# Altium schematic sheet Sheet1.SchDoc
size A
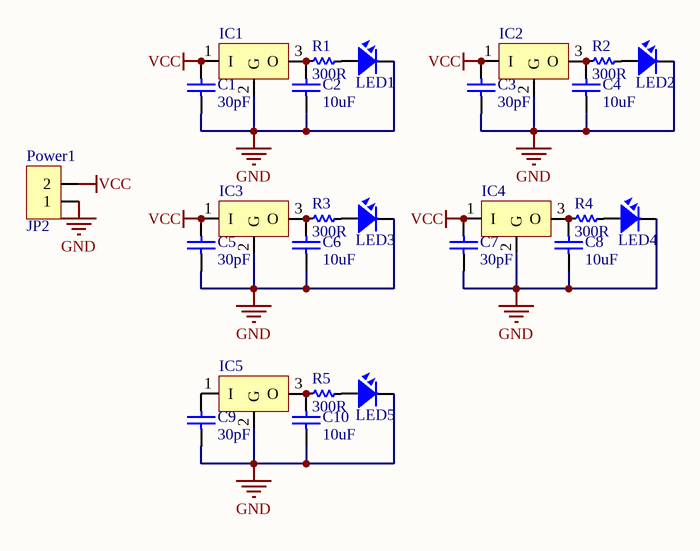
[diagram p0: Sheet1.SchDoc]

## Parts
C1  value 30pF  [C-NP-0805]  (hidden comment: Cap Non-pol)
C2  value 10uF  [C-NP-0805]  (hidden comment: Cap Non-pol)
C3  value 30pF  [C-NP-0805]  (hidden comment: Cap Non-pol)
C4  value 10uF  [C-NP-0805]  (hidden comment: Cap Non-pol)
C5  value 30pF  [C-NP-0805]  (hidden comment: Cap Non-pol)
C6  value 10uF  [C-NP-0805]  (hidden comment: Cap Non-pol)
C7  value 30pF  [C-NP-0805]  (hidden comment: Cap Non-pol)
C8  value 10uF  [C-NP-0805]  (hidden comment: Cap Non-pol)
C9  value 30pF  [C-NP-0805]  (hidden comment: Cap Non-pol)
C10  value 10uF  [C-NP-0805]  (hidden comment: Cap Non-pol)
IC1  LM78xx  [TO252-123]  (value not drawn)
IC2  LM78xx  [TO252-123]  (value not drawn)
IC3  LM78xx  [TO252-123]  (value not drawn)
IC4  LM78xx  [TO252-123]  (value not drawn)
IC5  LM78xx  [TO252-123]  (value not drawn)
LED1  LED  [LED-1206-Blue]  (value not drawn)
LED2  LED  [LED-1206-Blue]  (value not drawn)
LED3  LED  [LED-1206-Blue]  (value not drawn)
LED4  LED  [LED-1206-Blue]  (value not drawn)
LED5  LED  [LED-1206-Blue]  (value not drawn)
Power1  JP2  [JP2-D1T]
R1  300R  [RES-SMD-1206]
R2  300R  [RES-SMD-1206]
R3  300R  [RES-SMD-1206]
R4  300R  [RES-SMD-1206]
R5  300R  [RES-SMD-1206]

## Nets
GND: C1.2 C2.2 C3.2 C4.2 C5.2 C6.2 C7.2 C8.2 C9.2 C10.2 IC1.2(G) IC2.2(G) IC3.2(G) IC4.2(G) IC5.2(G) LED1.2 LED2.2 LED3.2 LED4.2 LED5.2 Power1.1
VCC: C1.1 C3.1 C5.1 C7.1 IC1.1(I) IC2.1(I) IC3.1(I) IC4.1(I) Power1.2
NetC2_1: C2.1 IC1.3(O) R1.1
NetC4_1: C4.1 IC2.3(O) R2.1
NetC6_1: C6.1 IC3.3(O) R3.1
NetC8_1: C8.1 IC4.3(O) R4.1
NetC9_1: C9.1 IC5.1(I)
NetC10_1: C10.1 IC5.3(O) R5.1
NetLED1_1: LED1.1 R1.2
NetLED2_1: LED2.1 R2.2
NetLED3_1: LED3.1 R3.2
NetLED4_1: LED4.1 R4.2
NetLED5_1: LED5.1 R5.2

## Library data of the parts
C1-C10 = Cap Non-pol: Non-polarized Capacitor; Published: 8-Jun-2000; LatestRevisionDate: 17-Jul-2002; LatestRevisionNote: Re-released for DXP Platform.; PackageReference: RAD-0.3; Publisher: Altium Limited
IC1-IC5 = LM78xx: Positive Voltage Regulator; Note: Tab is connected to pin 3 (GND).; Published: 24-Aug-2001; LatestRevisionDate: 17-Jul-2002; LatestRevisionNote: Re-released for DXP Platform.; DatasheetVersion: Apr-1994; PackageVersion: Jul-1998; PackageReference: ISOWATT220AB; Publisher: Altium Limited; PackageDescription: TO, Thru-Hole, Vertical, Heatsink Mounted; 3 In-Line Leads; Pitch 2.54 mm; Pin sequence 1, 3, 2; ComponentLink1Description: Manufacturer Link; ComponentLink1URL: http://www.st.com/; ComponentLink2Description: Datasheet; ComponentLink2URL: http://www.st.com/stonline/products/literature/ds/2146/l78m05c.pdf
LED1-LED5 = LED SMD: Value: LED 3 - 5 ly 2 Colour
Power1 = JP2: WR-PHD 2.54 mm Angled Socket Header; Manufacturer: W¨¹rth Elektronik eiSos GmbH; partNo: 613002143121; ComponentLink1 Description: Manufacturer; ComponentLink2 Description: Datasheet; NoPins: 02; Created Date: 29 March 2013; ComponentLink1URL: http://www.we-online.com; ComponentLink2URL: http://katalog.we-online.de/em/datasheet/6130xx143121.pdf; Created by: Karrer Zheng
R1-R5 = Res-SMD: Resistor; Manufacturer: Generic Components; Class: Passive; Published: 08/06/2000; Publisher: Altium Hobart Technology Centre